# Altium project HV_Board_Rev3.PrjPCB (part 1 of 2)
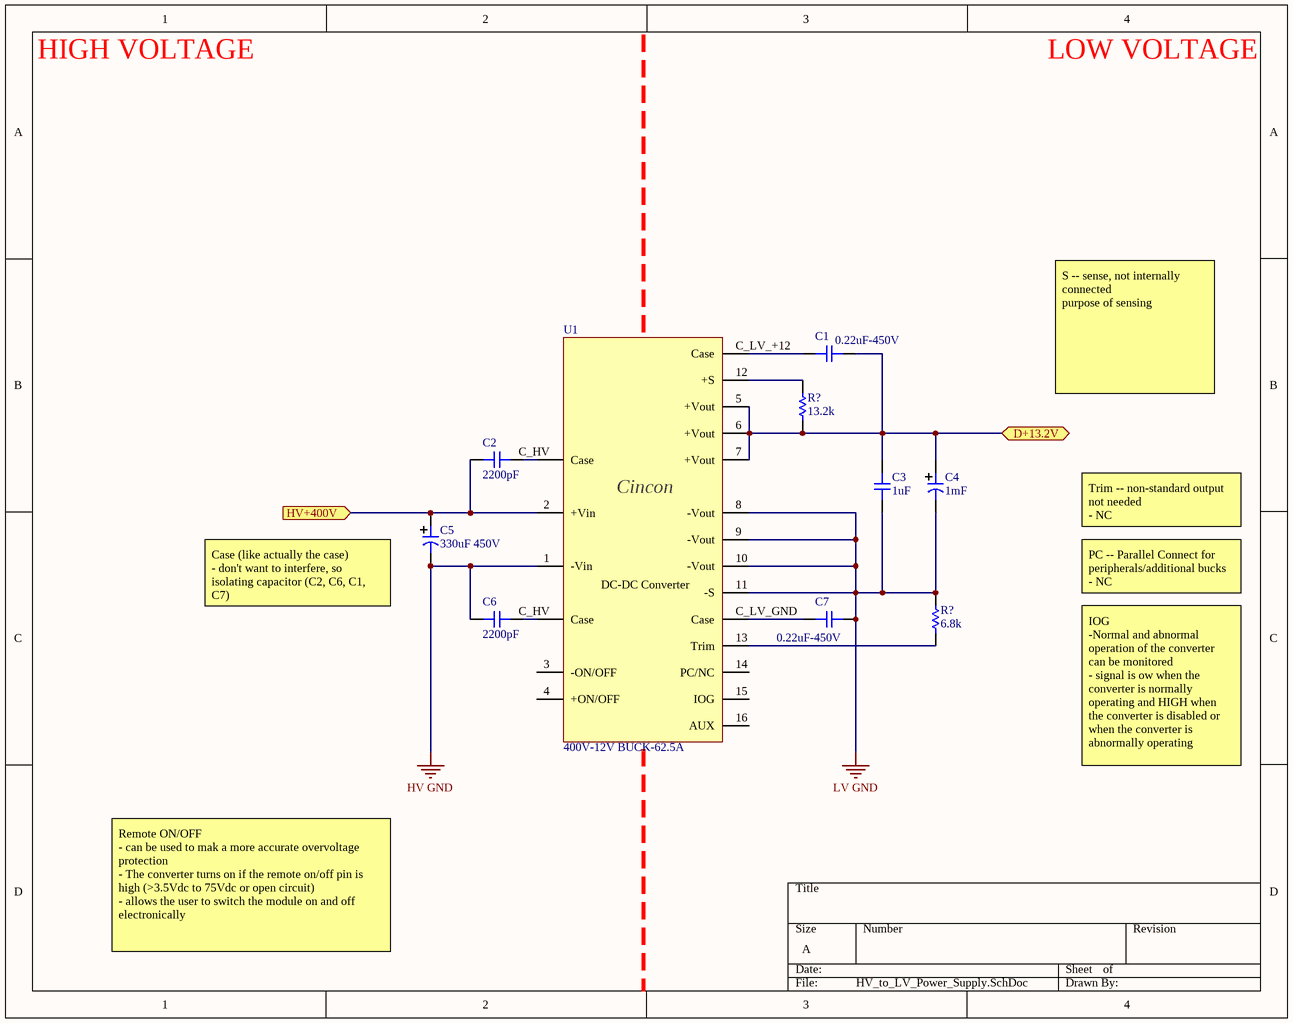
[diagram p0: HV_to_LV_Power_Supply.SchDoc]
6 sheets, 65 parts. Net scope: flat (ports and power ports of the same name join across sheets).
Board file: HV_Board_2022.PcbDoc
Sheets:
  HV_to_LV_Power_Supply.SchDoc
  Connectors_and_Protection.SchDoc
  VoltageMeasurement.SchDoc
  IMD.SchDoc
  3V3_PSU.SchDoc
  Current_Monitoring.SchDoc

## Sheet HV_to_LV_Power_Supply.SchDoc
size A

### Parts
(Parts that share a designator on the sheet are numbered #1, #2 ... from top to bottom, then left to right.)
C1  0.22uF-450V  [CAPC3025X28N]
C2  2200pF  [CAP-0805]
C3  1uF  [CAPC3025X28N]
C4  1mF  [CAPAE146136X170M]
C5  330uF 450V  [AEC 380LQ331M450A022]
C6  2200pF  [CAP-0805]
C7  0.22uF-450V  [CAPC3025X28N]
R?#1  13.2k  [RES-0603]
R?#2  6.8k  [RES-0603]
U1  400V-12V BUCK-62.5A  [CFB750-300S12]

### Ports
D+13.2V (bidir), HV+400V (in)

### Nets
HV GND: C5.2 C6.2 U1.1(-Vin)
LV GND: C3.1 C4.2 C7.2 R?#2.2 U1.8(-Vout) U1.9(-Vout) U1.10(-Vout) U1.11(-S)
NetC1_1: C1.1 U1.C_LV_+12(Case)
NetC1_2: C1.2 C3.2 C4.1(+) R?#1.1 U1.5(+Vout) U1.6(+Vout) U1.7(+Vout) ; port D+13.2V
NetC2_1: C2.1 U1.C_HV(Case)
NetC2_2: C2.2 C5.1(+) U1.2(+Vin) ; port HV+400V
NetC6_1: C6.1 U1.C_HV(Case)
NetC7_1: C7.1 U1.C_LV_GND(Case)
NetR?#1_2: R?#1.2 U1.12(+S)
NetR?#2_1: R?#2.1 U1.13(Trim)

Not connected (* = marked no-connect by the designer): U1 3(-ON/OFF) 4(+ON/OFF) 14(PC/NC) 15(IOG) 16(AUX)

### Notes on the sheet
- HIGH VOLTAGE
- LOW VOLTAGE
- S -- sense, not internally connected
  purpose of sensing
- Trim -- non-standard output
  not needed
  - NC
- (near C5) Case (like actually the case)
  - don't want to interfere, so isolating capacitor (C2, C6, C1, C7)
- PC -- Parallel Connect for peripherals/additional bucks
  - NC
- IOG
  -Normal and abnormal operation of the converter can be monitored
  - signal is ow when the converter is normally operating and HIGH when the converter is disabled or when the converter is abnormally operating
- Remote ON/OFF
  - can be used to mak a more accurate overvoltage protection
  - The converter turns on if the remote on/off pin is high (>3.5Vdc to 75Vdc or open circuit)
  - allows the user to switch the module on and off electronically
- (in symbol Cincon CFB750-300S12) Cincon; DC-DC Converter

### Library data of the parts
C1 C7 = 0.22uF-450V-1210: CAP CER 0.22UF 450V X7T 1210; Manufacturer: TDK; Manufacturer Part Number: C3225X7T2W224K200AE; Capacitance: 220nF; Tolerance: 10%; Supplier 1: Digi-Key; RoHS: Yes; Category: Ceramic Capacitors; Stock 1: 22849; Pricing 1: 1=0.90000, 10=0.66200, 50=0.52980, 100=0.45410, 500=0.35948 (USD); Mount: Surface Mount; Case/Package: 1210; Case Code (Imperial): 1210; Case Code (Metric): 3225; Weight: 0.000564oz; Min Operating Temperature: -55°C; Max Operating Temperature: 125°C; Packaging: Tape and Reel; Voltage Rating: 450V; Voltage Rating (DC): 450V; Package Quantity: 1000; Dielectric: X7T; Termination: SMD/SMT; Resistor Type: Ceramic; Features: Soft Termination; Series: C; Length: 3.2mm; Width: 2.5mm; Height: 2mm; Thickness: 0.098inch; Depth: 2.5mm; RoHS Compliant: Yes; ComponentLink1URL: https://datasheet.ciiva.com/24219/c3225x7t2w224k200ae-265393-24219702.pdf?src-supplier=Mouser; ComponentLink1Description: https://datasheet.ciiva.com/24219/c3225x7t2w224k200ae-265393-24219702.pdf?src-supplier=Mouser; Supplier Part Number 1: 445-8909-1-ND
C2 C6 = 2200pF-450V-0805: Cap Ceramic 0.0022uF 450V C0G 5% Pad SMD 0805 Soft Termination 125C Automotive T/R CGA4F4C0G2W222J085AE; Manufacturer: TDK; Supplier 1: Digi-Key; Manufacturer Part Number: CGA4F4C0G2W222J085AE; RoHS: Yes; Category: Ceramic Capacitors; Stock 1: 9544; Pricing 1: 1=0.51000, 10=0.35600, 50=0.24940, 100=0.21380, 500=0.16038, 1000=0.13543 (USD); RoHS Compliant: Yes; Supplier Part Number 1: 445-175690-1-ND
C3 = 1uF-50V-1210: CAP CER 1UF 50V X7R 1210 CL32B105KBHNNNE; Manufacturer: Samsung; Material: Ceramic; Tolerance: 10%; Supplier 1: Digi-Key; Manufacturer Part Number: CL32B105KBHNNNE; RoHS: Yes; Category: Ceramic Capacitors; Stock 1: 27840; Pricing 1: 1=0.26000, 10=0.17800, 50=0.11900, 100=0.10110, 500=0.07134, 1000=0.06243 (USD); Mount: Surface Mount; Case/Package: 1210; Case Code (Metric): 3225; Case Code (Imperial): 1210; Min Operating Temperature: -55°C; Max Operating Temperature: 125°C; Packaging: Tape and Reel; Package Quantity: 1; Capacitance: 1uF; Voltage Rating: 50V; Dielectric: X7R; Voltage: 50V; Series: CL; Construction: Flat; Length: 3.2mm; Width: 0.098inch; Height: 1.6mm; Thickness: 0.071inch; Depth: 2.5mm; Radiation Hardening: No; RoHS Compliant: Yes; ComponentLink1URL: https://datasheet.ciiva.com/15196/getdatasheetpartid-355242-15196145.pdf?src-supplier=Verical; ComponentLink1Description: https://datasheet.ciiva.com/15196/getdatasheetpartid-355242-15196145.pdf?src-supplier=Verical; ComponentLink2URL: https://datasheet.ciiva.com/29202/451199-da-01-en-vs-kondensator-1210-29202487.pdf?src-supplier=Conrad; ComponentLink2Description: https://datasheet.ciiva.com/29202/451199-da-01-en-vs-kondensator-1210-29202487.pdf?src-supplier=Conrad; ComponentLink3URL: https://datasheet.ciiva.com/16369/cl05b104kq5nnnc-16369702.pdf?src-supplier=Future+Electronics; ComponentLink3Description: https://datasheet.ciiva.com/16369/cl05b104kq5nnnc-16369702.pdf?src-supplier=Future+Electronics; Supplier Part Number 1: 1276-1811-1-ND
C4 = AEC-1mF-25V: CAP ALUM 1000UF 20% 25V SMD UUG1E102MNQ1MS; Manufacturer: Nichicon; Ripple Current: 820mA; Leakage Current: 10uA; Life (Hours): 2000Hour; Dissipation Factor: 0.16%; Supplier 1: Digi-Key; Manufacturer Part Number: UUG1E102MNQ1MS; RoHS: Yes; Category: Aluminum Electrolytic Capacitors; Stock 1: 77; Pricing 1: 1=1.53000, 10=1.20500, 50=1.04480 (USD); Mount: Surface Mount; Case/Package: Radial; Min Operating Temperature: -40°C; Max Operating Temperature: 85°C; Package Quantity: 1; Voltage Rating: 25V; Voltage Rating (DC): 25V; Tolerance: 20%; Packaging: Tape and Reel; Capacitance: 1mF; Termination: SMD/SMT; Ripple Current (AC): 820mA; Series: UG; Diameter: 12.5mm; Length: 16mm; Height: 16mm; Height - Seated (Max): 0.669inch; REACH SVHC: No SVHC; Lead Free: Contains Lead; RoHS Compliant: Yes; ComponentLink1URL: https://datasheet.ciiva.com/6311/e-ug-6311782.pdf?src-supplier=Digi-Key; ComponentLink1Description: https://datasheet.ciiva.com/6311/e-ug-6311782.pdf?src-supplier=Digi-Key; ComponentLink2URL: https://datasheet.ciiva.com/6311/e-ug-6311783.pdf?src-supplier=Digi-Key; ComponentLink2Description: https://datasheet.ciiva.com/6311/e-ug-6311783.pdf?src-supplier=Digi-Key; Supplier Part Number 1: 493-7421-1-ND
C5 = AEC-330uF-450V: Aluminum Electrolytic Capacitors - Snap In 330uF 450V 20% 380LQ331M450A022; Manufacturer: Cornell Dubilier; Dielectric Material: Aluminium; Ripple Current: 2.01A; ESR (Equivalent Series Resistance): 603mR; Life (Hours): 2000Hour; Supplier 1: Digi-Key; Manufacturer Part Number: 380LQ331M450A022; RoHS: Yes; Category: Aluminum Electrolytic Capacitors; Stock 1: 2991; Pricing 1: 1=6.30000, 10=5.67000, 50=4.91400, 100=4.28400, 500=3.52800, 1000=3.27600, 2500=3.21300, 5000=3.19200 (USD); Mount: Through Hole; Case/Package: Radial; Number of Pins: 2; Weight: 1.69315oz; Min Operating Temperature: -25°C; Max Operating Temperature: 85°C; Package Quantity: 40; Capacitance: 330uF; Voltage Rating: 450V; Tolerance: 20%; Packaging: Bulk; Voltage Rating (DC): 450V; Termination: Snap in; Features: General Purpose; Series: 380LQ; Diameter: 35mm; Length: 30mm; Height: 30mm; Height - Seated (Max): 1.181inch; Lead Pitch: 10mm; REACH SVHC: Unknown; Lead Free: Lead Free; RoHS Compliant: Yes; ComponentLink1URL: https://datasheet.ciiva.com/5372/380lq-5372414.pdf?src-supplier=Mouser; ComponentLink1Description: https://datasheet.ciiva.com/5372/380lq-5372414.pdf?src-supplier=Mouser
R?#1 = RT0603BRD0713K2L: High Precision-High Stability Chip Resistor Thin Film 0603 13.2kOhm 0.1% Paper T/R; Manufacturer: Yageo; Resistance: 13.2kR; Max Power Dissipation: 100mW; Temperature Coefficient: 25ppm/°C; Supplier 1: Mouser; Manufacturer Part Number: RT0603BRD0713K2L; RoHS: Yes; Category: Chip SMD Resistors; Stock 1: 2131; Pricing 1: 1=0.37000, 10=0.27400, 50=0.27400, 100=0.10700, 1000=0.05200, 10000=0.03700 (USD); Case/Package: 0603; Min Operating Temperature: -55°C; Max Operating Temperature: 155°C; Resistor Type: Thin Film; Packaging: Tape and Reel; Tolerance: 0.1%; Number of Terminations: 2; RoHS Compliant: Yes; ComponentLink1URL: http://www.yageo.com/documents/recent/PYu-RT_1-to-0.01_RoHS_L_9.pdf?src-supplier=Digi-Key; ComponentLink1Description: http://www.yageo.com/documents/recent/PYu-RT_1-to-0.01_RoHS_L_9.pdf?src-supplier=Digi-Key; Supplier Part Number 1: 603-RT0603BRD0713K2L
R?#2 = SFR03EZPF6801: Manufacturer: Rohm; Supplier 1: Mouser; Manufacturer Part Number: SFR03EZPF6801; RoHS: Yes; Stock 1: 14832; Pricing 1: 1=0.10000, 10=0.08800, 50=0.08800, 100=0.03400, 1000=0.01500, 10000=0.01100 (USD); RoHS Compliant: Yes; Supplier Part Number 1: 755-SFR03EZPF6801
U1 = Cincon CFB750-300S12: 750Watts Full Brick DC-DC Converter Input Voltage 200-425VDC to 12VDC, 62.5A; ComponentLink1Description: Datasheet; ComponentLink1URL: https://www.cincon.com/productdownload/CFB750-300S-series-application-note.pdf

## Sheet Connectors_and_Protection.SchDoc
size A
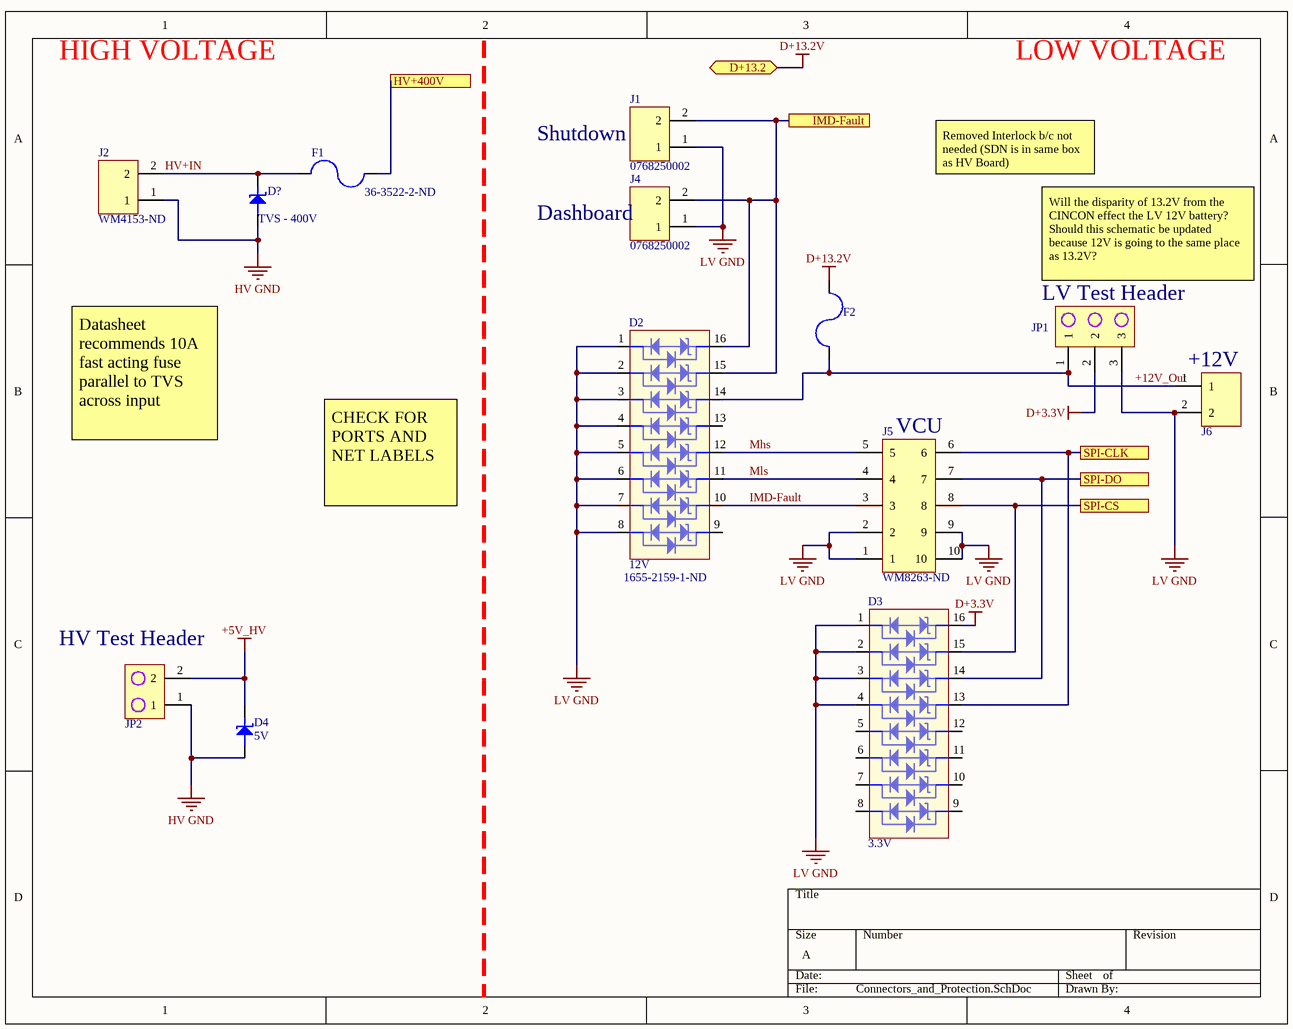
[diagram p1: Connectors_and_Protection.SchDoc]

### Parts
D2  12V  Supplier Part Number 1: 1655-2159-1-ND  [16-SO]
D3  3.3V  [16-SO]
D4  5V  [DIODE-SOD323]
D?  TVS - 400V  [DO-214AA, SMB]
F1  36-3522-2-ND  [Fuse Holder - 500V - 20A]
F2  36-3555-2-ND  [Fuse Holder - 500V - 50A]  (value not drawn)
J1  0768250002  [2X1PIN]
J2  WM4153-ND  [2PIN]
J4  0768250002  [2X1PIN]
J5  WM8263-ND  [2X5PIN]
J6  952-2900-ND  [2Pin-POWER]  (value not drawn)
JP1  732-5316-ND  [3PIN-JP]  (value not drawn)
JP2  732-5315-ND  [2PIN-JP]  (value not drawn)

### Ports
D+13.2 (bidir), HV+400V, IMD-Fault, SPI-CLK, SPI-CS, SPI-DO

### Nets
+5V_HV: D4.1 JP2.2
D+3.3V: D3.16 JP1.2
D+13.2V: F2.2 ; port D+13.2
HV GND: D4.2 D?.2 J2.1 JP2.1
LV GND: D2.1 D2.2 D2.3 D2.4 D2.5 D2.6 D2.7 D2.8 D3.1 D3.2 D3.3 D3.4 J1.1 J4.1 J5.1 J5.2 J5.9 J5.10 J6.2 JP1.3
+12V_Out: D2.14 F2.1 J6.1 JP1.1
HV+IN: D?.1 F1.1 J2.2
IMD-Fault: D2.10 J5.3
Mhs: D2.12 J5.5
Mls: D2.11 J5.4
NetC2_2: F1.2 ; port HV+400V
NetD2_15: D2.15 D2.16 J1.2 J4.2 ; port IMD-Fault
NetD3_13: D3.13 J5.6 ; port SPI-CLK
NetD3_14: D3.14 J5.7 ; port SPI-DO
NetD3_15: D3.15 J5.8 ; port SPI-CS

Not connected (* = marked no-connect by the designer): D2 9 13; D3 5 6 7 8 9 10 11 12

### Notes on the sheet
- HIGH VOLTAGE
- LOW VOLTAGE
- Shutdown
- Removed Interlock b/c not needed (SDN is in same box as HV Board)
- (near J4) Dashboard
- (near JP1) LV Test Header
- Will the disparity of 13.2V from the CINCON effect the LV 12V battery? Should this schematic be updated because 12V is going to the same place as 13.2V?
- (near J6) +12V
- Datasheet recommends 10A fast acting fuse parallel to TVS across input
- (near J5) VCU
- CHECK FOR PORTS AND NET LABELS
- (near JP2) HV Test Header

### Library data of the parts
D2 = TVS-12V-X8: PD 300W VWM 12VCJ 25PFPACKAGE SO; Supplier 1: Digi-Key
D3 = TVS-3.3V-X8: PD 300W VWM 3.3VCJ 25PFPACKAGE S; Supplier 1: Digi-Key; Supplier Part Number 1: 1655-2157-1-ND
D4 = TVS-5V: TVS DIODE 5V SOD323; Manufacturer: Nexperia; Manufacturer Part Number: PESD5V0U1UA,115; Supplier 1: Digi-Key; Stock 1: 127058; Pricing 1: 1=0.43, 10=0.32, 25=0.28, 100=0.152, 250=0.1512, 500=0.124, 1000=0.092 (USD); ComponentLink1URL: https://assets.nexperia.com/documents/data-sheet/PESD5V0U1UA_UB_UL.pdf?src-supplier=Digi-Key; ComponentLink1Description: https://assets.nexperia.com/documents/data-sheet/PESD5V0U1UA_UB_UL.pdf?src-supplier=Digi-Key; ComponentLink2URL: http://www.farnell.com/datasheets/453996.pdf?src-supplier=Farnell; ComponentLink2Description: http://www.farnell.com/datasheets/453996.pdf?src-supplier=Farnell; Supplier Part Number 1: 1727-4155-6-ND
D? = SMBJE400CA: Manufacturer: Eaton Bussmann; Supplier 1: Digi-Key; Manufacturer Part Number: SMBJE400CA; RoHS: No; Stock 1: 2965; Pricing 1: 1=0.44000, 10=0.37500, 100=0.28030, 500=0.22022, 1000=0.17017 (USD); Supplier Part Number 1: 283-SMBJE400CACT-ND
F1 = Fuse Holder - 500V - 20A: FUSE CLIP BLADE 500V 20A PCB; Supplier 1: Digi-Key
F2 = Fuse Holder - 500V - 50A: FUSE BLOCK BLADE 500V 50A PCB; Supplier 1: Digi-Key
J1 J4 = 2X1PIN: CONN HEADER R/A 2POS; Manufacturer: Molex; Manufacturer Part Number: 76825-0002; Number of Circuits: 2; Gender: Male; Pitch: 5.7mm; Supplier 1: Digi-Key; Stock 1: 0; Pricing 1: 1=1.13, 10=0.993, 25=0.9344, 50=0.8956, 100=0.8567, 250=0.7788, 500=0.70092, 1000=0.62304, 2500=0.56463 (USD); Color: Black; Contact Plating: Tin; Contact Material: Copper; Termination: Through Hole; Number of Rows: 2; Orientation: Right Angle; Number of Contacts: 2; REACH SVHC: Unknown; ComponentLink1URL: http://www.farnell.com/datasheets/1968956.pdf?src-supplier=Element14; ComponentLink1Description: http://www.farnell.com/datasheets/1968956.pdf?src-supplier=Element14; ComponentLink2URL: http://www.farnell.com/datasheets/2216551.pdf?src-supplier=Newark; ComponentLink2Description: http://www.farnell.com/datasheets/2216551.pdf?src-supplier=Newark; ComponentLink3URL: http://www.farnell.com/datasheets/2216551.pdf?src-supplier=Farnell; ComponentLink3Description: http://www.farnell.com/datasheets/2216551.pdf?src-supplier=Farnell; ComponentLink4URL: https://www.molex.com/pdm_docs/sd/768250002_sd.pdf?src-supplier=Digi-Key; ComponentLink4Description: https://www.molex.com/pdm_docs/sd/768250002_sd.pdf?src-supplier=Digi-Key; ComponentLink5URL: http://www.farnell.com/datasheets/2001779.pdf?src-supplier=Element14; ComponentLink5Description: http://www.farnell.com/datasheets/2001779.pdf?src-supplier=Element14; ComponentLink6URL: http://www.alliedelec.com/images/products/datasheets/bm/BrandonData/70717238.pdf?src-supplier=Allied+Electronics; ComponentLink6Description: http://www.alliedelec.com/images/products/datasheets/bm/BrandonData/70717238.pdf?src-supplier=Allied+Electronics; Supplier Part Number 1: WM11969-ND
J2 = 2PIN: CONN HEADER R/A 2POS 2.54MM; Manufacturer: Molex; Manufacturer Part Number: 0705530106; Number of Positions: 2; Contact Resistance: 30mR; Connector Type: Male Pin; Supplier 1: Digi-Key; Stock 1: 2224; Pricing 1: 1=1.38, 10=1.25, 100=1.071, 500=0.8925, 1000=0.765, 5000=0.6783, 10000=0.663 (USD); Mount: Through Hole; Housing Material: Polyester; Contact Plating: Gold; Contact Material: Bronze; Color: Black; Housing Color: Black; Min Operating Temperature: -40°C; Max Operating Temperature: 105°C; Number of Rows: 1; Packaging: Rail/Tube; Termination: Solder; Number of Contacts: 2; Orientation: Right Angle; Length: 7.37mm; Pitch: 2.54mm; Depth: 13.59mm; Contact Mating Length: 0.24inch; ComponentLink1URL: http://www.molex.com/webdocs/datasheets/pdf/en-us/0705530106_PCB_HEADERS.pdf?src-supplier=Avnet+Asia; ComponentLink1Description: http://www.molex.com/webdocs/datasheets/pdf/en-us/0705530106_PCB_HEADERS.pdf?src-supplier=Avnet+Asia; ComponentLink2URL: https://www.molex.com/pdm_docs/ps/PS-70400.pdf?src-supplier=Digi-Key; ComponentLink2Description: https://www.molex.com/pdm_docs/ps/PS-70400.pdf?src-supplier=Digi-Key; Supplier Part Number 1: WM4153-ND
J5 = 2X5PIN: CONN HEADER R/A 10POS 2.54MM; Manufacturer: Molex; Manufacturer Part Number: 90130-3110; Number of Positions: 10; Connector Type: Male Pin; Max Voltage Rating (DC): 350.35kV; Max Voltage Rating (AC): 350V; Gender: Male; Current Rating: 3A; Row Spacing: 0.1inch; Glow Wire Compliant: Non-compliant; Supplier 1: Digi-Key; Stock 1: 3596; Pricing 1: 1=1.47, 10=1.329, 100=1.1395, 500=0.94956, 1000=0.8139, 5000=0.72166, 10000=0.70538 (USD); Mount: Through Hole; Color: Black; Housing Color: Black; Housing Material: Polyester; Contact Material: Brass; Contact Plating: Tin,Lead; Min Operating Temperature: -55°C; Max Operating Temperature: 125°C; Number of Rows: 2; Packaging: Tray; Termination: Solder; Orientation: Right Angle; Number of Contacts: 10; Package Quantity: 1; Voltage Rating: 350V; Number of Circuits: 10; Voltage Rating (DC): 350V; Length: 15.42mm; Pitch: 2.54mm; Depth: 9.75mm; Contact Mating Length: 0.266inch; Radiation Hardening: No; Flammability Rating: UL94 V-0; REACH SVHC: No SVHC; Lead Free: Lead Free; ComponentLink1URL: http://www.mouser.com/ds/2/276/0901303110_PCB_HEADERS-151522.pdf?src-supplier=Mouser; ComponentLink1Description: http://www.mouser.com/ds/2/276/0901303110_PCB_HEADERS-151522.pdf?src-supplier=Mouser; ComponentLink2URL: http://uk.rs-online.com/webdocs/13c4/0900766b813c4c8e.pdf?src-supplier=RSComponents; ComponentLink2Description: http://uk.rs-online.com/webdocs/13c4/0900766b813c4c8e.pdf?src-supplier=RSComponents; ComponentLink3URL: http://www.molex.com/webdocs/datasheets/pdf/en-us/0901303110_PCB_HEADERS.pdf?src-supplier=Avnet; ComponentLink3Description: http://www.molex.com/webdocs/datasheets/pdf/en-us/0901303110_PCB_HEADERS.pdf?src-supplier=Avnet; ComponentLink4URL: http://www.molex.com/pdm_docs/sd/901303110_sd.pdf?src-supplier=Digi-Key; ComponentLink4Description: http://www.molex.com/pdm_docs/sd/901303110_sd.pdf?src-supplier=Digi-Key; ComponentLink5URL: http://www.molex.com/webdocs/datasheets/pdf/en-us/0901303110_PCB_HEADERS.pdf?src-supplier=Avnet+Europe; ComponentLink5Description: http://www.molex.com/webdocs/datasheets/pdf/en-us/0901303110_PCB_HEADERS.pdf?src-supplier=Avnet+Europe; Supplier Part Number 1: WM8263-ND
J6 = 2PIN-POWER: CONN HEADER VERT 2POS 4MM 800V 40A; Supplier 1: Digi-Key; Supplier Part Number 1: 952-2900-ND
JP1 = 3PIN-TEST: CONN HEADER VERT 3POS 2.54MM
JP2 = 2PIN-TEST: CONN HEADER VERT 2POS 2.54MM

## Sheet VoltageMeasurement.SchDoc
size A4; SheetNumber: 1; SheetTotal: 3; Schematic: Voltage Measurement
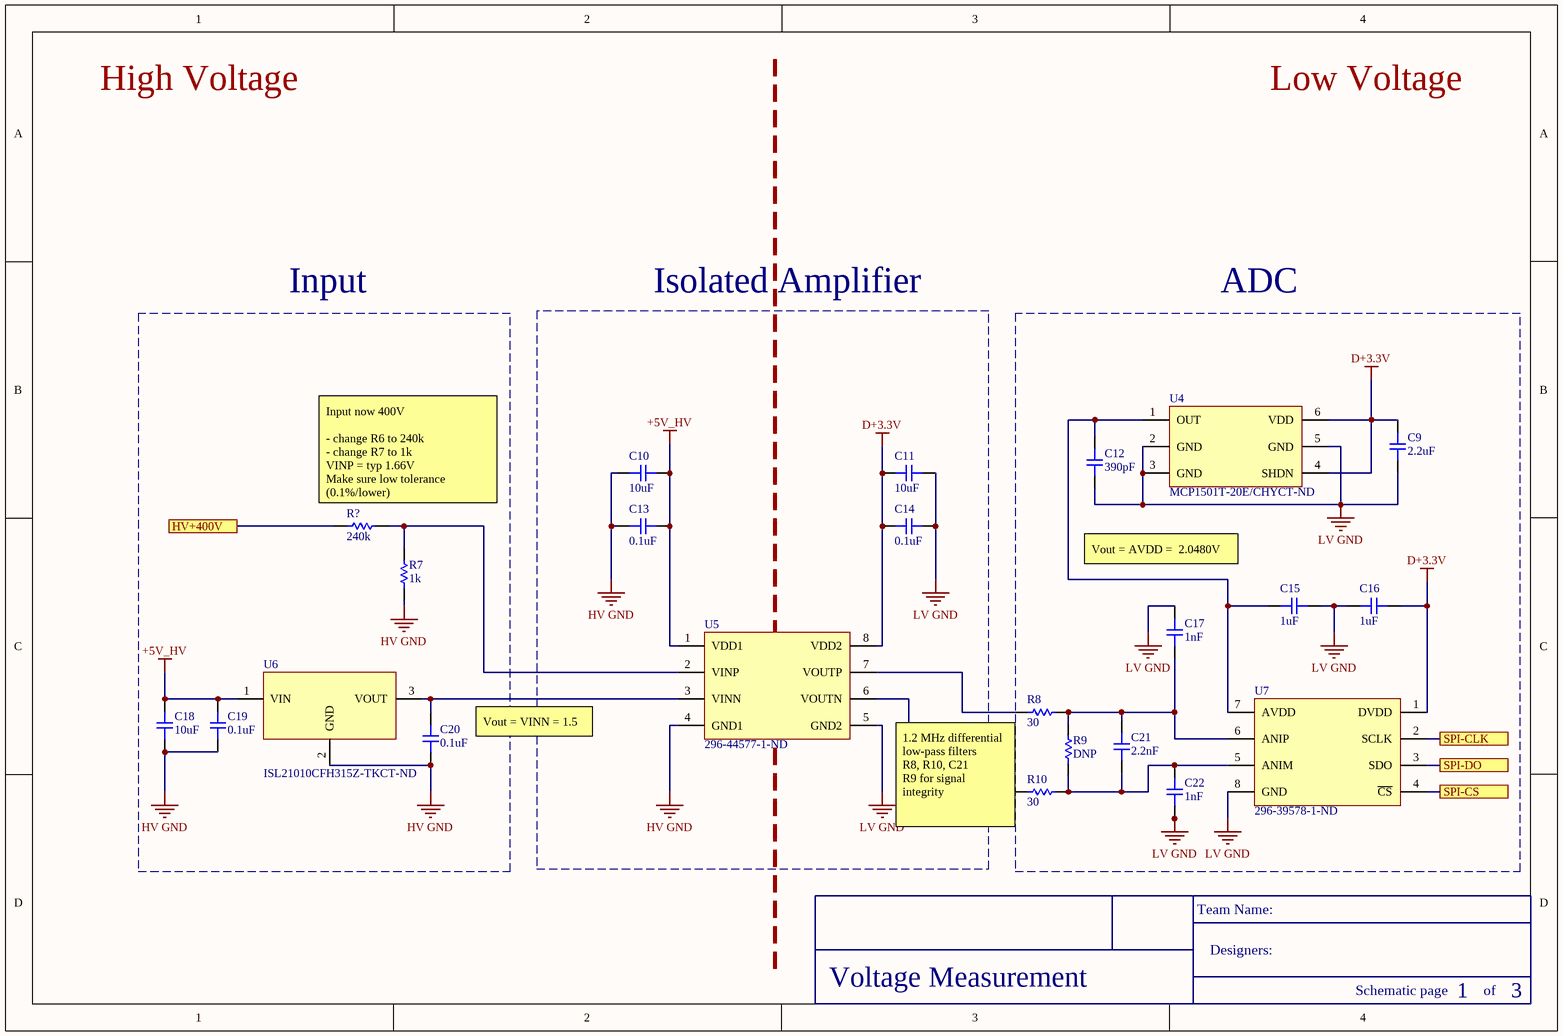
[diagram p2: VoltageMeasurement.SchDoc]

### Parts
(Parts that share a designator on the sheet are numbered #1, #2 ... from top to bottom, then left to right.)
C9#1  2.2uF  [CAP-0603]
C10  10uF  [CAP-1206]
C11  10uF  [CAP-1206]
C12  390pF  [CAP-0805]
C13  0.1uF  [CAP-0805]
C14  0.1uF  [CAP-0805]
C15  1uF  [CAP-0805]
C16  1uF  [CAP-0805]
C17  1nF  [CAP-0603]
C18  10uF  [CAP-1206]
C19  0.1uF  [CAP-0805]
C20  0.1uF  [CAP-0805]
C21  2.2nF  [CAP-0603]
C22  1nF  [CAP-0603]
R7  1k  [RES-0603]
R8  30  [RES-0805]
R9  DNP  [RES-0805]
R10  30  [RES-0805]
R?#3  240k  [RES-0603]
U4  MCP1501T-20E/CHYCT-ND  [SOT-23-6]
U5  296-44577-1-ND  [8-SOICW]
U6  ISL21010CFH315Z-TKCT-ND  [SOT-23-3]
U7  296-39578-1-ND  [8VSSOP]

### Blocks framed on the sheet
Input: C18-C20 R7 R?#3 U6
Isolated Amplifier: C10 C11 C13 C14 U5
ADC: C9#1 C12 C15-C17 C21 C22 R8-R10 U4 U7

### Ports
HV+400V (in), SPI-CLK, SPI-CS, SPI-DO

### Nets
+5V_HV: C10.2 C13.2 C18.2 C19.2 U5.1(VDD1) U6.1(VIN)
D+3.3V: C9#1.2 C11.1 C14.1 C16.2 U4.4(SHDN) U4.6(VDD) U5.8(VDD2) U7.1(DVDD)
HV GND: C10.1 C13.1 C18.1 C19.1 C20.1 R7.1 U5.4(GND1) U6.2(GND)
LV GND: C9#1.1 C11.2 C12.1 C14.2 C15.2 C16.1 C17.2 C22.1 U4.2(GND) U4.3(GND) U4.5(GND) U5.5(GND2) U7.8(GND)
NetC12_2: C12.2 C15.1 U4.1(OUT) U7.7(AVDD)
NetC17_1: C17.1 C21.2 R8.2 R9.2 U7.6(ANIP)
NetC20_2: C20.2 U5.3(VINN) U6.3(VOUT)
NetC21_1: C21.1 C22.2 R9.1 R10.2 U7.5(ANIM)
NetD3_13: U7.2(SCLK) ; port SPI-CLK
NetD3_14: U7.3(SDO) ; port SPI-DO
NetD3_15: U7.4(~{CS}) ; port SPI-CS
NetR7_2: R7.2 R?#3.2 U5.2(VINP)
NetR8_1: R8.1 U5.7(VOUTP)
NetR10_1: R10.1 U5.6(VOUTN)

Not connected (* = marked no-connect by the designer): R?#3 1

### Notes on the sheet
- (near R?#3) Input now 400V
  - change R6 to 240k
  - change R7 to 1k
  VINP = typ 1.66V
  Make sure low tolerance (0.1%/lower)
- Vout = AVDD =  2.0480V
- (near C20) Vout = VINN = 1.5
- 1.2 MHz differential low-pass filters
  R8, R10, C21
  R9 for signal integrity
- High Voltage
- Low Voltage
- Team Name:
- Designers:
- Schematic page
- of

### Library data of the parts
C9#1 = 0603-2.2uF-25V: CAP CER 2.2UF 25V X5R 0603; Manufacturer: Murata; Manufacturer Part Number: GRM188R61E225MA12D; Tolerance: 20%; Supplier 1: Digi-Key; Stock 1: 132633; Pricing 1: 1=0.16, 10=0.115, 100=0.0539, 500=0.03782, 1000=0.0313 (USD); Mount: Surface Mount; Case/Package: 0603; Weight: 0.000222oz; Case Code (Metric): 1608; Case Code (Imperial): 0603; Min Operating Temperature: -55°C; Max Operating Temperature: 85°C; Capacitance: 2.2uF; Packaging: Tape and Reel; Voltage Rating: 25V; Dielectric: X5R; Termination: SMD/SMT; Composition: Ceramic; Voltage Rating (DC): 25V; Package Quantity: 4000; Length: 0.063inch; Height: 0.8mm; Width: 0.031inch; Thickness: 0.035inch; ComponentLink1URL: http://search.murata.co.jp/Ceramy/image/img/A01X/G101/ENG/GRM188R61E225MA12-01.pdf?src-supplier=Digi-Key; ComponentLink1Description: http://search.murata.co.jp/Ceramy/image/img/A01X/G101/ENG/GRM188R61E225MA12-01.pdf?src-supplier=Digi-Key; ComponentLink2URL: http://www.mouser.com/ds/2/281/c02e-2905.pdf?src-supplier=Mouser; ComponentLink2Description: http://www.mouser.com/ds/2/281/c02e-2905.pdf?src-supplier=Mouser; Supplier Part Number 1: 490-12738-6-ND
C10 C11 C18 = 1206-10uF-50V: CAP CER 10UF 50V X5R 1206; Manufacturer: Murata; Manufacturer Part Number: GRT31CR61H106ME01L; Tolerance: 20%; Supplier 1: Digi-Key; Stock 1: 247205; Pricing 1: 1=0.5, 10=0.349, 100=0.2092, 500=0.1569, 1000=0.13249 (USD); Mount: Surface Mount; Case/Package: 1206; Case Code (Metric): 3216; Case Code (Imperial): 1206; Min Operating Temperature: -55°C; Max Operating Temperature: 85°C; Packaging: Tape and Reel; Capacitance: 10uF; Voltage Rating: 50V; Length: 0.126inch; Width: 0.063inch; Thickness: 0.071inch; Ratings: AEC-Q200; ComponentLink1URL: http://search.murata.co.jp/Ceramy/image/img/A01X/G101/ENG/GRT31CR61H106ME01-01.pdf?src-supplier=Digi-Key; ComponentLink1Description: http://search.murata.co.jp/Ceramy/image/img/A01X/G101/ENG/GRT31CR61H106ME01-01.pdf?src-supplier=Digi-Key; Supplier Part Number 1: 490-12457-1-ND
C12 = 0805-390pF-50V: CAP CER 390PF 50V C0G/NP0 0805; Manufacturer: KEMET; Manufacturer Part Number: C0805C391J5GACTU; Dielectric Material: Ceramic; Tolerance: 5%; Dissipation Factor: 0.1%; Dielectric: C0G; Supplier 1: Digi-Key; Stock 1: 12778; Pricing 1: 1=0.15, 10=0.105, 100=0.0495, 500=0.03472, 1000=0.02875 (USD); Mount: Surface Mount,PCB; Case/Package: 0805; Case Code (Metric): 2012; Case Code (Imperial): 0805; Contact Material: Tin; Contact Plating: Tin,Matte; Min Operating Temperature: -55°C; Max Operating Temperature: 125°C; Package Quantity: 1; Capacitance: 390pF; Voltage Rating: 50V; Packaging: Tape and Reel; Termination: SMD/SMT; Voltage Rating (DC): 50V; Voltage: 50V; Length: 2mm; Height: 0.78mm; Width: 0.049inch; Lead Pitch: 0.75mm; Depth: 1.25mm; Thickness: 0.035inch; Radiation Hardening: No; REACH SVHC: No SVHC; Lead Free: Lead Free; ComponentLink1URL: https://search.kemet.com/component-edge/download/datasheet/C0805C391J5GACTU.pdf?src-supplier=Digi-Key; ComponentLink1Description: https://search.kemet.com/component-edge/download/datasheet/C0805C391J5GACTU.pdf?src-supplier=Digi-Key; ComponentLink2URL: https://www.verical.com/server-webapp/html/getDatasheet?partID=35246&src-supplier=Verical; ComponentLink2Description: https://www.verical.com/server-webapp/html/getDatasheet?partID=35246&src-supplier=Verical; ComponentLink3URL: https://www.alliedelec.com/m/d/9bfe7773041ffe9d406e68bc7b377fdd.pdf?src-supplier=Allied+Electronics; ComponentLink3Description: https://www.alliedelec.com/m/d/9bfe7773041ffe9d406e68bc7b377fdd.pdf?src-supplier=Allied+Electronics; ComponentLink4URL: http://www.farnell.com/datasheets/1372242.pdf?src-supplier=Element14; ComponentLink4Description: http://www.farnell.com/datasheets/1372242.pdf?src-supplier=Element14; ComponentLink5URL: http://www.jameco.com/Jameco/Products/ProdDS/1567367.pdf?src-supplier=Jameco; ComponentLink5Description: http://www.jameco.com/Jameco/Products/ProdDS/1567367.pdf?src-supplier=Jameco; Supplier Part Number 1: 399-1132-6-ND
C13 C14 C19 C20 = 0805-0.1uF-16V: CAP CER 0.1UF 16V Y5V 0805; Manufacturer: KEMET; Manufacturer Part Number: C0805C104Z4VACTU; Dielectric Material: Ceramic; Capacitance: 100nF; Tolerance: 80%; Supplier 1: Digi-Key; Stock 1: 18565; Pricing 1: 1=0.11, 10=0.081, 100=0.038, 500=0.02664, 1000=0.02205 (USD); Mount: Surface Mount; Case/Package: 0805; Case Code (Metric): 2012; Case Code (Imperial): 0805; Min Operating Temperature: -30°C; Max Operating Temperature: 85°C; Package Quantity: 1; Voltage Rating: 16V; Packaging: Tape and Reel; Voltage Rating (DC): 16V; Dielectric: Y5V; Termination: SMD/SMT; Length: 2mm; Height: 0.78mm; Width: 0.049inch; Thickness: 0.035inch; Lead Pitch: 0.75mm; Depth: 1.25mm; Lead Free: Lead Free; ComponentLink1URL: https://search.kemet.com/component-edge/download/datasheet/C0805C104Z4VACTU.pdf?src-supplier=Digi-Key; ComponentLink1Description: https://search.kemet.com/component-edge/download/datasheet/C0805C104Z4VACTU.pdf?src-supplier=Digi-Key; ComponentLink2URL: https://api.kemet.com/component-edge/download/datasheet/C0805C104Z4VACTU.pdf?src-supplier=Digi-Key; ComponentLink2Description: https://api.kemet.com/component-edge/download/datasheet/C0805C104Z4VACTU.pdf?src-supplier=Digi-Key; ComponentLink3URL: http://www.mouser.com/ds/2/212/KEM_C1005_Y5V_SMD-1101305.pdf?src-supplier=Mouser; ComponentLink3Description: http://www.mouser.com/ds/2/212/KEM_C1005_Y5V_SMD-1101305.pdf?src-supplier=Mouser; ComponentLink4URL: http://components.arrow.com/part/dataview/2091119S8993596N7429?src-supplier=Arrow; ComponentLink4Description: http://components.arrow.com/part/dataview/2091119S8993596N7429?src-supplier=Arrow; Supplier Part Number 1: 399-9159-6-ND
C15 C16 = 0805-1uF-16V: CAP CER 1UF 16V Y5V 0805; Manufacturer: KEMET; Manufacturer Part Number: C0805C105Z4VACTU; Dielectric Material: Ceramic; Tolerance: 80%; Dissipation Factor: 7%; Supplier 1: Digi-Key; Stock 1: 54729; Pricing 1: 1=0.12, 10=0.085, 100=0.0378, 500=0.02702, 1000=0.02124 (USD); Mount: Surface Mount,PCB; Case/Package: 0805; Number of Pins: 2; Case Code (Metric): 2012; Case Code (Imperial): 0805; Contact Material: Tin; Min Operating Temperature: -30°C; Max Operating Temperature: 85°C; Package Quantity: 1; Capacitance: 1uF; Voltage Rating: 16V; Packaging: Tape and Reel; Voltage Rating (DC): 16V; Dielectric: Y5V; Termination: SMD/SMT; Voltage: 16V; Length: 2mm; Height: 1.25mm; Width: 0.049inch; Thickness: 0.055inch; Lead Pitch: 0.75mm; Depth: 1.25mm; Radiation Hardening: No; REACH SVHC: No SVHC; Lead Free: Lead Free; ComponentLink1URL: http://www.farnell.com/datasheets/2739656.pdf?src-supplier=Farnell; ComponentLink1Description: http://www.farnell.com/datasheets/2739656.pdf?src-supplier=Farnell; ComponentLink2URL: http://capacitoredge.kemet.com/capedge2/DataSheet?pn=C0805C105Z4VAC7800&src-supplier=Avnet+Europe; ComponentLink2Description: http://capacitoredge.kemet.com/capedge2/DataSheet?pn=C0805C105Z4VAC7800&src-supplier=Avnet+Europe; ComponentLink3URL: https://www.alliedelec.com/m/d/9bfe7773041ffe9d406e68bc7b377fdd.pdf?src-supplier=Allied+Electronics; ComponentLink3Description: https://www.alliedelec.com/m/d/9bfe7773041ffe9d406e68bc7b377fdd.pdf?src-supplier=Allied+Electronics; ComponentLink4URL: http://www.farnell.com/datasheets/2739656.pdf?src-supplier=Newark; ComponentLink4Description: http://www.farnell.com/datasheets/2739656.pdf?src-supplier=Newark; Supplier Part Number 1: 399-8011-6-ND
C17 C22 = 0603-1nF-50V: CAP CER 1000PF 50V X7R 0603; Manufacturer: KEMET; Manufacturer Part Number: C0603C102J5RACTU; Dielectric Material: Ceramic; Tolerance: 5%; Dissipation Factor: 2.5%; Supplier 1: Digi-Key; Stock 1: 378254; Pricing 1: 1=0.1, 10=0.056, 100=0.0248, 500=0.01772, 1000=0.01392 (USD); Mount: Surface Mount; Case/Package: 0603; Number of Pins: 2; Case Code (Imperial): 0603; Case Code (Metric): 1608; Min Operating Temperature: -55°C; Max Operating Temperature: 125°C; Packaging: Tape and Reel; Capacitance: 1nF; Dielectric: X7R; Voltage Rating (DC): 50V; Package Quantity: 1; Voltage Rating: 50V; Termination: SMD/SMT; Length: 1.6mm; Height: 0.8mm; Width: 0.031inch; Depth: 0.8mm; Thickness: 0.034inch; Lead Pitch: 0.7mm; Radiation Hardening: No; REACH SVHC: No SVHC; ComponentLink1URL: http://www.onlinecomponents.com/productFiles/mf-KEM/docfinderpartnumberc0402c102k5ractu.pdf?src-supplier=Onlinecomponents.com; ComponentLink1Description: http://www.onlinecomponents.com/productFiles/mf-KEM/docfinderpartnumberc0402c102k5ractu.pdf?src-supplier=Onlinecomponents.com; Supplier Part Number 1: 399-1083-6-ND
C21 = 0603-2.2nF-50V: CAP CER SMD 0603 2200PF 10% X7R; Manufacturer: KEMET; Manufacturer Part Number: C0603C222K5RAC7411; Dielectric Material: Ceramic; Voltage Rating: 50V; Dissipation Factor: 2.5%; Supplier 1: Digi-Key; Stock 1: 56383; Pricing 1: 1=0.1, 10=0.042, 100=0.0186, 500=0.01328, 1000=0.01044, 2500=0.00949, 5000=0.00873 (USD); Mount: Surface Mount; Case/Package: 0603; Case Code (Imperial): 0603; Case Code (Metric): 1608; Min Operating Temperature: -55°C; Max Operating Temperature: 125°C; Capacitance: 2.2nF; Tolerance: 10%; Package Quantity: 10000; Packaging: Tape and Reel; Voltage Rating (DC): 50V; Dielectric: X7R; Termination: SMD/SMT; Length: 1.6mm; Height: 0.8mm; Width: 0.8mm; Lead Pitch: 0.7mm; Depth: 0.8mm; Radiation Hardening: No; ComponentLink1URL: http://www.mouser.com/ds/2/212/KEM_C1002_X7R_SMD-1102033.pdf?src-supplier=Mouser; ComponentLink1Description: http://www.mouser.com/ds/2/212/KEM_C1002_X7R_SMD-1102033.pdf?src-supplier=Mouser; Supplier Part Number 1: 399-17586-6-ND
R7 = RT0603BRE071KL: Res High precision Thin Film 0603 1K Ohm 0.1% 1/10W ±50ppm/°C Molded SMD Paper T/R; Manufacturer: Yageo; Resistance: 1kR; Power Rating: 100mW; Voltage Rating (DC): 50V; Supplier 1: Arrow Electronics; Manufacturer Part Number: RT0603BRE071KL; RoHS: Yes; Category: Chip SMD Resistors; Stock 1: 2241; Pricing 1: 1=0.37640, 10=0.22610, 25=0.22380, 100=0.10140, 250=0.10040, 500=0.09940, 1000=0.06050 (USD); Case/Package: 0603; Case Code (Metric): 1608; Case Code (Imperial): 0603; Size Code: 0603; Min Operating Temperature: -55°C; Max Operating Temperature: 155°C; Tolerance: 0.1%; Packaging: Tape and Reel; Package Quantity: 5000; Resistor Type: Thin Film; Number of Terminations: 2; Max Power Dissipation: 100mW; Temperature Coefficient: 50ppm/°C; Features: Moisture Resistant; Series: RT; Construction: Rectangular; Length: 0.063inch; Width: 0.031inch; Height: 0.022inch; Depth: 0.8mm; Military Standard: Not; Lead Free: Lead Free; RoHS Compliant: Yes; ComponentLink1URL: https://datasheet.ciiva.com/2584/pyu-rt-1-to-0-05-rohs-l-5-2584317.pdf?src-supplier=Digi-Key; ComponentLink1Description: https://datasheet.ciiva.com/2584/pyu-rt-1-to-0-05-rohs-l-5-2584317.pdf?src-supplier=Digi-Key; Supplier Part Number 1: RT0603BRE071KL
R8 R10 = 0805-30R: RES SMD 30 OHM 1% 1/8W 0805; Supplier 1: Digi-Key; Supplier Part Number 1: P30.0CCT-ND
R?#3 = RT0603BRD07240KL: Res Thin Film 0603 240K Ohm 0.1% 1/10W ±25ppm/°C Molded SMD SMD Paper T/R; Manufacturer: Yageo; Resistance: 240kR; Power Rating: 100mW; Voltage Rating: 75V; Voltage Rating (DC): 50V; Supplier 1: Arrow Electronics; Manufacturer Part Number: RT0603BRD07240KL; RoHS: Yes; Category: Chip SMD Resistors; Stock 1: 575; Pricing 1: 1=0.29290, 10=0.24440, 25=0.24200, 100=0.09940, 250=0.09840, 500=0.09740 (USD); Case/Package: 0603; Case Code (Metric): 1608; Case Code (Imperial): 0603; Contact Plating: Tin,Matte; Min Operating Temperature: -55°C; Max Operating Temperature: 125°C; Tolerance: 0.1%; Packaging: Tape and Reel; Resistor Type: Thin Film; Number of Terminations: 2; Termination: SMD/SMT; Max Power Dissipation: 100mW; Temperature Coefficient: 25ppm/°C; Features: Moisture Resistant; Series: RT; Length: 0.063inch; Width: 0.031inch; Height: 0.022inch; Radiation Hardening: No; Lead Free: Lead Free; RoHS Compliant: Yes; ComponentLink1URL: https://datasheet.ciiva.com/12725/pyu-rt-1-to-0-05-rohs-l-4-12725717.pdf?src-supplier=Mouser; ComponentLink1Description: https://datasheet.ciiva.com/12725/pyu-rt-1-to-0-05-rohs-l-4-12725717.pdf?src-supplier=Mouser; Supplier Part Number 1: RT0603BRD07240KL
U4 = VREF 2.048V 0.1%: IC VREF SERIES 0.1% SOT23-6; Supplier 1: Digi-Key; Supplier Part Number 1: MCP1501T-20E/CHYCT-ND
U5 = OPAMP-ISO-AMC1301DWVR: IC OPAMP ISOLATION 1 CIRC 8SOIC; Manufacturer: Texas Instruments; Number of Circuits: 1; Gain Bandwidth Product: 1MHz; Input Bias Current: 60uA; Input Offset Voltage (Vos): 50uV; Operating Supply Current: 5.9mA; Output Current per Channel: 13mA; Isolation Voltage: 1kV; Bandwidth: 210kHz; Supplier 1: Digi-Key; Manufacturer Part Number: AMC1301DWVR; Stock 1: 2458; Pricing 1: 1=6.07, 10=5.487, 25=5.2316, 100=4.3384, 250=3.9556, 500=3.7004 (USD); Mount: Surface Mount; Case/Package: SOIC; Number of Pins: 8; Min Operating Temperature: -40°C; Max Operating Temperature: 125°C; Packaging: Cut Tape; Number of Amplifiers: 1; REACH SVHC: No SVHC; Lead Free: Lead Free; ComponentLink1URL: http://www.ti.com/lit/wp/sszy024/sszy024.pdf?src-supplier=Digi-Key; ComponentLink1Description: http://www.ti.com/lit/wp/sszy024/sszy024.pdf?src-supplier=Digi-Key; ComponentLink2URL: http://www.ti.com/lit/ds/symlink/amc1301.pdf?src-supplier=Farnell; ComponentLink2Description: http://www.ti.com/lit/ds/symlink/amc1301.pdf?src-supplier=Farnell; ComponentLink3URL: http://www.farnell.com/datasheets/2113482.pdf?src-supplier=Element14; ComponentLink3Description: http://www.farnell.com/datasheets/2113482.pdf?src-supplier=Element14; Supplier Part Number 1: 296-44577-6-ND
U6 = VREF 1.5V 0.2%: IC VREF SERIES 0.2% SOT23-3; Supplier 1: Digi-Key; Supplier Part Number 1: ISL21010CFH315Z-TKCT-ND
U7 = ADC-ADS7044IDCUR: IC ADC 12BIT SAR 8VSSOP; Manufacturer: Texas Instruments; Manufacturer Part Number: ADS7044IDCUT; Number of Bits: 12; Sampling Rate: 1MS/s; Number of Inputs: 1; Interface: SPI; Resolution: 12b; Polarity: Unipolar; Signal to Noise Ratio (SNR): 71dB; Supply Type: Analog,Digital; Max Power Dissipation: 900uW; Min Dual Supply Voltage: 1.8V; Max Supply Voltage: 3.6V; Integral Nonlinearity (INL): 2LSB; Supplier 1: Digi-Key; Stock 1: 68; Pricing 1: 1=2.66, 10=2.385, 25=2.2544, 100=1.8537 (USD); Mount: Surface Mount; Case/Package: SOP; Number of Pins: 8; Weight: 0.030018oz; Contact Plating: Gold; Min Operating Temperature: -40°C; Max Operating Temperature: 125°C; Packaging: Tape and Reel; Number of A/D Converters: 1; Number of Analog Inputs: 1; Number of Channels: 1; Package Quantity: 250; Max Dual Supply Voltage: 3.6V; Lead Free: Lead Free; ComponentLink1URL: http://www.ti.com/general/docs/lit/getliterature.tsp?genericPartNumber=ADS7044&&fileType=pdf&src-supplier=Avnet; ComponentLink1Description: http://www.ti.com/general/docs/lit/getliterature.tsp?genericPartNumber=ADS7044&&fileType=pdf&src-supplier=Avnet; ComponentLink2URL: http://www.ti.com/lit/ds/symlink/ads7044.pdf?src-supplier=Digi-Key; ComponentLink2Description: http://www.ti.com/lit/ds/symlink/ads7044.pdf?src-supplier=Digi-Key; ComponentLink3URL: http://www.ti.com/lit/gpn/ads7044?src-supplier=Mouser; ComponentLink3Description: http://www.ti.com/lit/gpn/ads7044?src-supplier=Mouser; Supplier Part Number 1: 296-39578-6-ND

## Sheet IMD.SchDoc
size A4
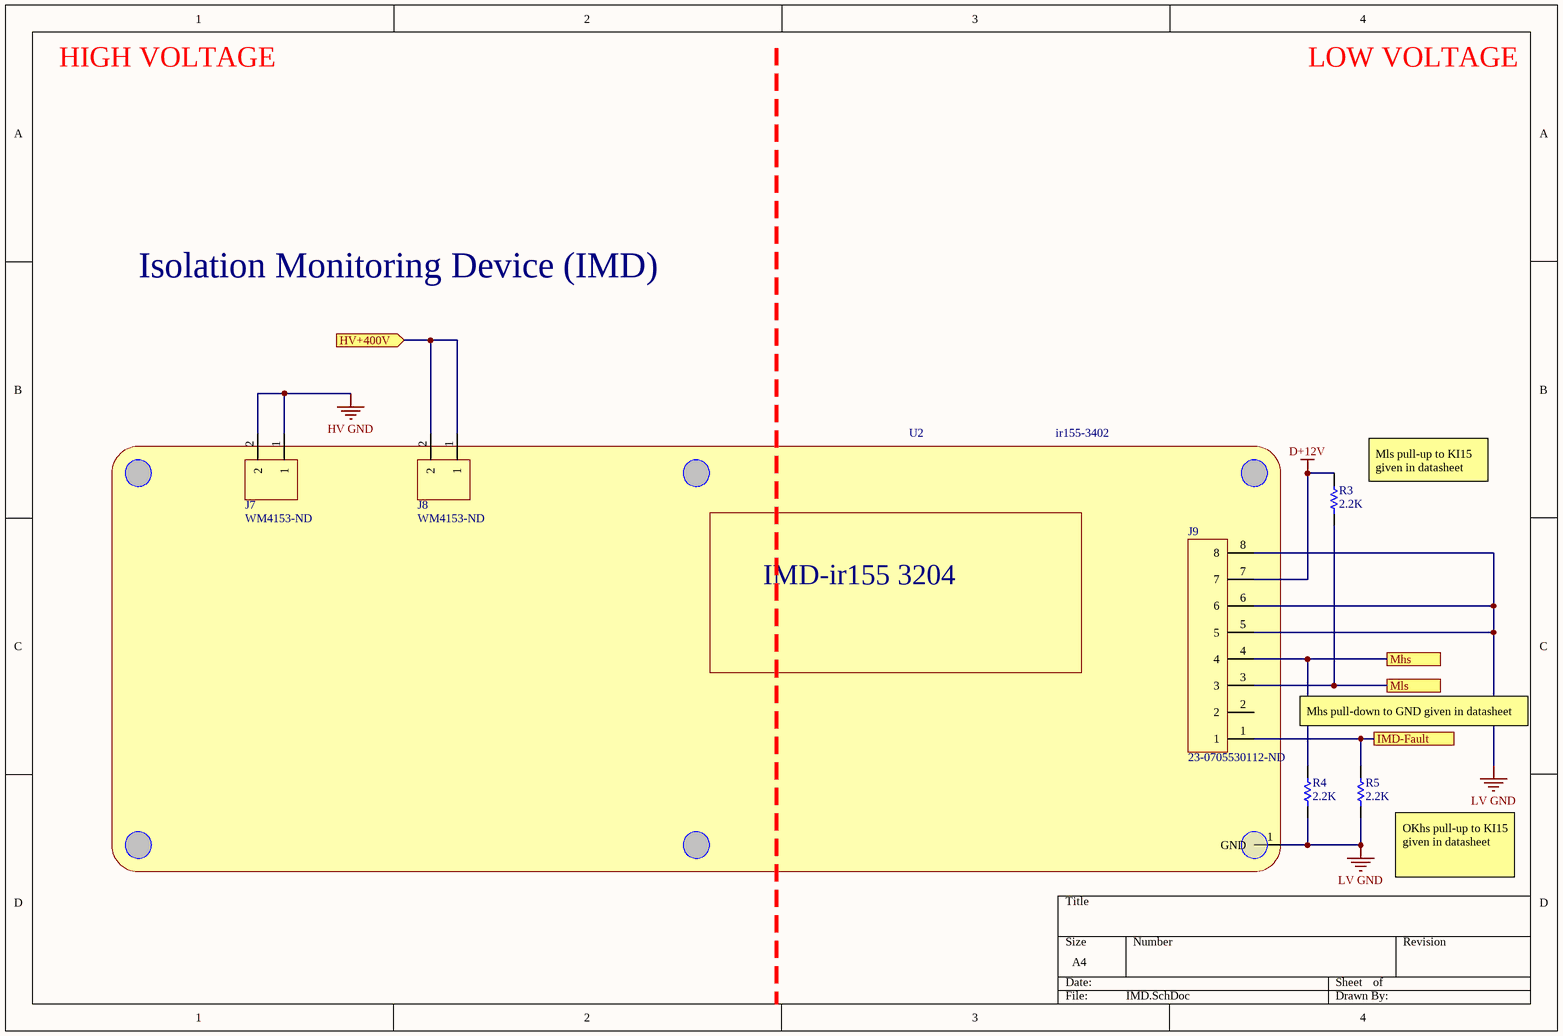
[diagram p3: IMD.SchDoc]

### Parts
J7  WM4153-ND  [2PIN]
J8  WM4153-ND  [2PIN]
J9  23-0705530112-ND  [8PIN]
R3  2.2K  [RES-0805]
R4  2.2K  [RES-0805]
R5  2.2K  [RES-0805]
U2  ir155-3402  [IMD-Bender ir155 3204]

### Ports
HV+400V (in), IMD-Fault, Mhs, Mls

### Nets
D+12V: J9.7 R3.2
HV GND: J7.1 J7.2
LV GND: J9.5 J9.6 J9.8 R4.1 R5.1 U2.1(GND)
NetC2_2: J8.1 J8.2 ; port HV+400V
NetD2_15: J9.1 R5.2 ; port IMD-Fault
NetJ9_3: J9.3 R3.1 ; port Mls
NetJ9_4: J9.4 R4.2 ; port Mhs

Not connected (* = marked no-connect by the designer): J9 2

### Notes on the sheet
- HIGH VOLTAGE
- LOW VOLTAGE
- Isolation Monitoring Device (IMD)
- (near R3) Mls pull-up to KI15 given in datasheet
- Mhs pull-down to GND given in datasheet
- (near R5) OKhs pull-up to KI15 given in datasheet
- (in symbol IMD-ir155-3402) IMD-ir155 3204

### Library data of the parts
J7 J8 = 2PIN: as J2 on sheet Connectors_and_Protection; Supplier 1: Digi-Key; Stock 1: 2224; Pricing 1: 1=1.38, 10=1.25, 100=1.071, 500=0.8925, 1000=0.765, 5000=0.6783, 10000=0.663 (USD); Mount: Through Hole; Housing Material: Polyester; Contact Plating: Gold; Contact Material: Bronze; Color: Black; Housing Color: Black; Min Operating Temperature: -40°C; Max Operating Temperature: 105°C; Number of Rows: 1; Packaging: Rail/Tube; Termination: Solder; Number of Contacts: 2; Orientation: Right Angle; Length: 7.37mm; Pitch: 2.54mm; Depth: 13.59mm; Contact Mating Length: 0.24inch; ComponentLink1URL: http://www.molex.com/webdocs/datasheets/pdf/en-us/0705530106_PCB_HEADERS.pdf?src-supplier=Avnet+Asia; ComponentLink1Description: http://www.molex.com/webdocs/datasheets/pdf/en-us/0705530106_PCB_HEADERS.pdf?src-supplier=Avnet+Asia; ComponentLink2URL: https://www.molex.com/pdm_docs/ps/PS-70400.pdf?src-supplier=Digi-Key; ComponentLink2Description: https://www.molex.com/pdm_docs/ps/PS-70400.pdf?src-supplier=Digi-Key; Supplier Part Number 1: WM4153-ND
J9 = 8PIN: CONN HEADER R/A 8POS 2.54MM; Manufacturer: Molex; Manufacturer Part Number: 70553-0112; Contact Resistance: 30mR; Current Rating: 3A; Voltage Rating: 250V; Number of Positions: 8; Insulation Resistance: 1GR; Connector Type: Male Pin; Glow Wire Compliant: Non-compliant; Supplier 1: Digi-Key; Stock 1: 1363; Pricing 1: 1=2.43, 10=2.205, 100=1.89, 500=1.575, 1000=1.35, 5000=1.197, 10000=1.17 (USD); Mount: Through Hole; Color: Black; Contact Material: Bronze; Contact Plating: Gold; Material: Brass; Housing Material: Thermoplastic; Min Operating Temperature: -40°C; Max Operating Temperature: 105°C; Package Quantity: 1; Number of Rows: 1; Packaging: Rail/Tube; Termination: Solder; Number of Contacts: 8; Orientation: Right Angle; Voltage Rating (DC): 250V; Number of Circuits: 8; Pitch: 2.54mm; Contact Mating Length: 0.24inch; ELV: Compliant; Flammability Rating: UL94 V-0; ComponentLink1URL: https://www.molex.com/pdm_docs/ps/PS-70400.pdf?src-supplier=Digi-Key; ComponentLink1Description: https://www.molex.com/pdm_docs/ps/PS-70400.pdf?src-supplier=Digi-Key; ComponentLink2URL: http://www.mouser.com/ds/2/276/0705530112_PCB_HEADERS-172840.pdf?src-supplier=Mouser; ComponentLink2Description: http://www.mouser.com/ds/2/276/0705530112_PCB_HEADERS-172840.pdf?src-supplier=Mouser; Supplier Part Number 1: 23-0705530112-ND
R3-R5 = 0805-2.2KR: RES SMD 2.2K OHM 1% 1/8W 0805; Manufacturer: Yageo; Manufacturer Part Number: RC0805FR-072K2L; Power Rating: 125mW; Resistance: 2.2kR; Temperature Coefficient: 100ppm/°C; Voltage Rating: 150V; Supplier 1: Digi-Key; Stock 1: 4156138; Pricing 1: 1=0.1, 10=0.04, 100=0.0163, 1000=0.00731, 2500=0.00635 (USD); Case/Package: 0805; Number of Pins: 2; Case Code (Imperial): 0805; Case Code (Metric): 2012; Min Operating Temperature: -55°C; Max Operating Temperature: 155°C; Tolerance: 1%; Packaging: Tape and Reel; Voltage Rating (DC): 150V; Package Quantity: 1; Termination: SMD/SMT; Composition: Thick Film; Number of Terminations: 2; Max Power Dissipation: 125mW; Features: Moisture Resistant; Military Standard: Not; Length: 2mm; Height: 0.5mm; Width: 1.25mm; Depth: 1.25mm; Lead Pitch: 0.4mm; REACH SVHC: Unknown; Lead Free: Lead Free; ComponentLink1URL: http://www.farnell.com/datasheets/38627.pdf?src-supplier=Element14; ComponentLink1Description: http://www.farnell.com/datasheets/38627.pdf?src-supplier=Element14; ComponentLink2URL: http://www.farnell.com/datasheets/444164.pdf?src-supplier=Element14; ComponentLink2Description: http://www.farnell.com/datasheets/444164.pdf?src-supplier=Element14; ComponentLink3URL: http://www.yageo.com/documents/recent/PYu-RC_Group_51_RoHS_L_9.pdf?src-supplier=Digi-Key; ComponentLink3Description: http://www.yageo.com/documents/recent/PYu-RC_Group_51_RoHS_L_9.pdf?src-supplier=Digi-Key; ComponentLink4URL: http://www.yageo.com/documents/recent/PYu-RC_Group_51_RoHS_L_10.pdf?src-supplier=Digi-Key; ComponentLink4Description: http://www.yageo.com/documents/recent/PYu-RC_Group_51_RoHS_L_10.pdf?src-supplier=Digi-Key; Supplier Part Number 1: 311-2.20KCRDKR-ND
U2 = IMD-ir155-3402: ISOMETER iso-F1 IR155-3204 / https://www.bender.de/fileadmin/content/Products/d/e/IR155-32xx-V004_D00115_D_XXEN.pdf

## Sheet 3V3_PSU.SchDoc
size A4
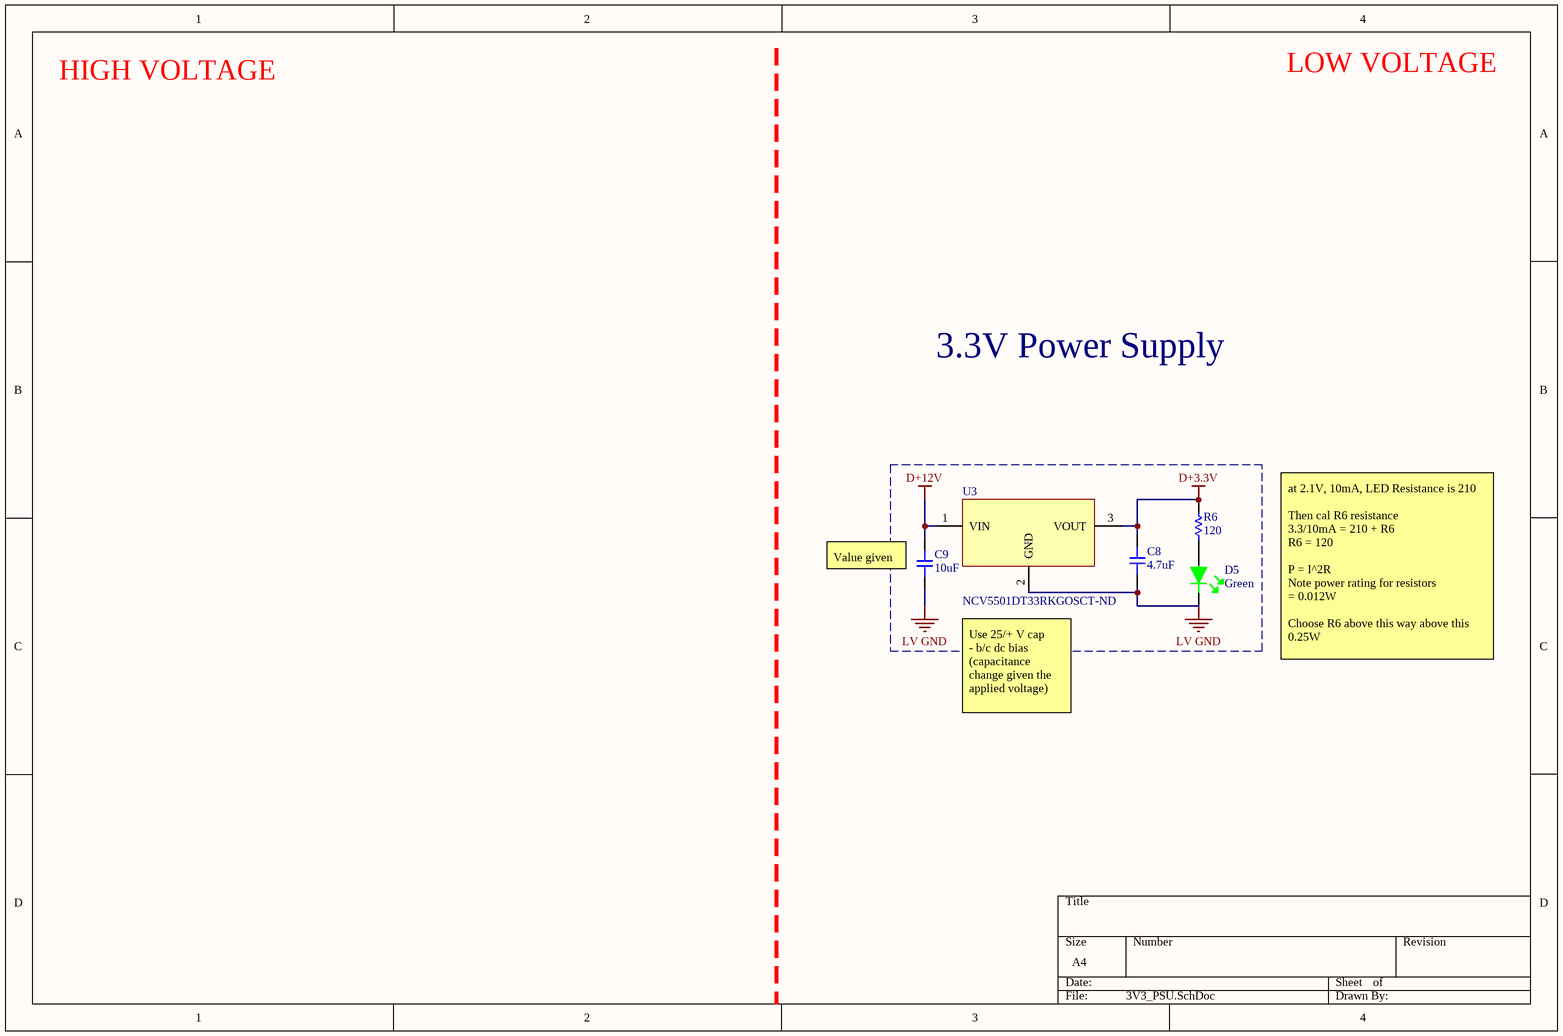
[diagram p4: 3V3_PSU.SchDoc]

### Parts
(Parts that share a designator on the sheet are numbered #1, #2 ... from top to bottom, then left to right.)
C8  4.7uF  [CAP-0805]
C9#2  10uF  [CAP-1206]
D5  Green  [LED-0603]
R6  120  [RESC1608X06N]
U3  NCV5501DT33RKGOSCT-ND  [DPAK-TO252]

### Nets
D+3.3V: C8.2 R6.2 U3.3(VOUT)
D+12V: C9#2.2 U3.1(VIN)
LV GND: C8.1 C9#2.1 D5.2 U3.2(GND)
NetD5_1: D5.1 R6.1

### Notes on the sheet
- HIGH VOLTAGE
- LOW VOLTAGE
- 3.3V Power Supply
- (near C9#2) Value given
- at 2.1V, 10mA, LED Resistance is 210
  Then cal R6 resistance
  3.3/10mA = 210 + R6
  R6 = 120
  P = I^2R
  Note power rating for resistors
  = 0.012W
  Choose R6 above this way above this
  0.25W
- Use 25/+ V cap
  - b/c dc bias (capacitance change given the applied voltage)

### Library data of the parts
C8 = 0805-4.7uF-16V: CAP CER 4.7UF 16V X5R 0805; Manufacturer: KEMET; Manufacturer Part Number: C0805C475K4PACTU; Dielectric Material: Ceramic; Tolerance: 10%; Supplier 1: Digi-Key; Stock 1: 96594; Pricing 1: 1=0.24, 10=0.168, 100=0.0951, 500=0.0671, 1000=0.05872 (USD); Mount: Surface Mount; Case/Package: 0805; Min Operating Temperature: -55°C; Max Operating Temperature: 85°C; Capacitance: 4.7uF; Packaging: Tape and Reel; Dielectric: X5R; Voltage: 16V; Termination: SMD/SMT; Voltage Rating (DC): 16V; Length: 2mm; Height: 1.25mm; Depth: 1.25mm; Radiation Hardening: No; Lead Free: Lead Free; ComponentLink1URL: http://capacitoredge.kemet.com/capedge2/DataSheet?pn=C0805C475K4PAC7800&src-supplier=Avnet+Europe; ComponentLink1Description: http://capacitoredge.kemet.com/capedge2/DataSheet?pn=C0805C475K4PAC7800&src-supplier=Avnet+Europe; ComponentLink2URL: https://www.verical.com/server-webapp/html/getDatasheet?partID=319476&src-supplier=Verical; ComponentLink2Description: https://www.verical.com/server-webapp/html/getDatasheet?partID=319476&src-supplier=Verical; Supplier Part Number 1: 399-8101-6-ND
C9#2 = 1206-10uF-50V: as C10 on sheet VoltageMeasurement; Supplier 1: Digi-Key; Stock 1: 247205; Pricing 1: 1=0.5, 10=0.349, 100=0.2092, 500=0.1569, 1000=0.13249 (USD); Mount: Surface Mount; Case/Package: 1206; Case Code (Metric): 3216; Case Code (Imperial): 1206; Min Operating Temperature: -55°C; Max Operating Temperature: 85°C; Packaging: Tape and Reel; Capacitance: 10uF; Voltage Rating: 50V; Length: 0.126inch; Width: 0.063inch; Thickness: 0.071inch; Ratings: AEC-Q200; ComponentLink1URL: http://search.murata.co.jp/Ceramy/image/img/A01X/G101/ENG/GRT31CR61H106ME01-01.pdf?src-supplier=Digi-Key; ComponentLink1Description: http://search.murata.co.jp/Ceramy/image/img/A01X/G101/ENG/GRT31CR61H106ME01-01.pdf?src-supplier=Digi-Key; Supplier Part Number 1: 490-12457-1-ND
D5 = LED-Green: LED GREEN CLEAR 0603 SMD; Manufacturer: Wurth Electronics; Manufacturer Part Number: 150060VS75000; Luminous Intensity: 40mcd; Viewing Angle: 140°; Forward Voltage: 2V; Wavelength: 570nm; Lens Style: Clear,Rectangular; Forward Current: 30mA; Test Current: 20mA; Supplier 1: Digi-Key; Stock 1: 118118; Pricing 1: 1=0.14, 50=0.133, 100=0.114, 500=0.099 (USD); Mount: Surface Mount; Case/Package: 0603; Number of Pins: 2; Color: Green; Case Code (Metric): 1608; Case Code (Imperial): 0603; Min Operating Temperature: -40°C; Max Operating Temperature: 85°C; Package Quantity: 1; Packaging: Tape and Reel; Dominant Wavelength: 570nm; Length: 1.6mm; Height: 0.7mm; Width: 0.8mm; REACH SVHC: Unknown; ComponentLink1URL: https://katalog.we-online.de/led/datasheet/150060VS75000.pdf?src-supplier=Digi-Key; ComponentLink1Description: https://katalog.we-online.de/led/datasheet/150060VS75000.pdf?src-supplier=Digi-Key; Supplier Part Number 1: 732-4980-1-ND
R6 = ESR03EZPJ121: Res Thick Film 0603 120 Ohm 5% 0.25W(1/4W) ±200ppm/C Epoxy Resin Pad SMD Automotive T/R; Manufacturer: Rohm; Resistance: 120R; Power Rating: 250mW; Temperature Coefficient: 200ppm/°C; Supplier 1: Avnet; Manufacturer Part Number: ESR03EZPJ121; RoHS: Yes; Category: Chip SMD Resistors; Stock 1: 35000; Pricing 1: 5000=0.00936, 10000=0.00886, 20000=0.00835, 30000=0.00784, 40000=0.00734, 50000=0.00683, 500000=0.00633 (USD); Case/Package: 0603; Case Code (Metric): 1608; Case Code (Imperial): 0603; Size Code: 0603; Min Operating Temperature: -55°C; Max Operating Temperature: 155°C; Tolerance: 5%; Package Quantity: 1; Packaging: Tape and Reel; Resistor Type: Thick Film; Number of Terminations: 2; Max Power Dissipation: 250mW; Features: Automotive AEC-Q200; Series: ESR; Length: 0.063inch; Width: 0.031inch; Height: 0.022inch; Lead Free: Lead Free; RoHS Compliant: Yes; ComponentLink1URL: https://datasheet.ciiva.com/2495/esr-2495284.pdf?src-supplier=Digi-Key; ComponentLink1Description: https://datasheet.ciiva.com/2495/esr-2495284.pdf?src-supplier=Digi-Key; ComponentLink2URL: https://datasheet.ciiva.com/2495/esr-2495285.pdf?src-supplier=Digi-Key; ComponentLink2Description: https://datasheet.ciiva.com/2495/esr-2495285.pdf?src-supplier=Digi-Key; ComponentLink3URL: https://datasheet.ciiva.com/2495/esr-2495286.pdf?src-supplier=Digi-Key; ComponentLink3Description: https://datasheet.ciiva.com/2495/esr-2495286.pdf?src-supplier=Digi-Key; Supplier Part Number 1: ESR03EZPJ121
U3 = LDO-3.3V-500mA: IC REG LINEAR 3.3V 500MA DPAK; Manufacturer: ON Semiconductor; Min Input Voltage: 2.5V; Number of Outputs: 1; Max Input Voltage: 16V; Dropout Voltage: 230mV; Polarity: Positive; Accuracy: 2.9%; Output Type: Fixed; Supplier 1: Digi-Key; Manufacturer Part Number: NCV5501DT33RKG; Stock 1: 921; Pricing 1: 1=0.8, 10=0.7, 25=0.6576, 100=0.4984, 250=0.4242, 500=0.403, 1000=0.30755 (USD); Mount: Surface Mount; Case/Package: DPAK; Number of Pins: 3; Contact Plating: Tin,Matte; Min Operating Temperature: -40°C; Max Operating Temperature: 125°C; Output Voltage: 3.3V; Output Current: 500mA; Packaging: Tape and Reel; Max Output Current: 500mA; Package Quantity: 1; Number of Regulators: 1; Min Current Limit: 500mA; Min Output Voltage: 3.3V; Nominal Output Voltage: 3.3V; Output Voltage Accuracy: 2.9%; Length: 6.73mm; Height: 2.38mm; Width: 6.22mm; Radiation Hardening: No; REACH SVHC: No SVHC; Lead Free: Lead Free; ComponentLink1URL: http://www.onsemi.com/pub_link/Collateral/NCP5500-D.PDF?src-supplier=Future+Electronics; ComponentLink1Description: http://www.onsemi.com/pub_link/Collateral/NCP5500-D.PDF?src-supplier=Future+Electronics; ComponentLink2URL: http://www.onsemi.cn/pub_link/Collateral/NCP5500-D.PDF?src-supplier=Avnet; ComponentLink2Description: http://www.onsemi.cn/pub_link/Collateral/NCP5500-D.PDF?src-supplier=Avnet; ComponentLink3URL: http://www.onsemi.com/pub/Collateral/NCP5500-D.PDF?src-supplier=Avnet; ComponentLink3Description: http://www.onsemi.com/pub/Collateral/NCP5500-D.PDF?src-supplier=Avnet; ComponentLink4URL: http://www.onsemi.com/pub/Collateral/NCP5500-D.PDF?src-supplier=Digi-Key; ComponentLink4Description: http://www.onsemi.com/pub/Collateral/NCP5500-D.PDF?src-supplier=Digi-Key; Supplier Part Number 1: NCV5501DT33RKGOSDKR-ND